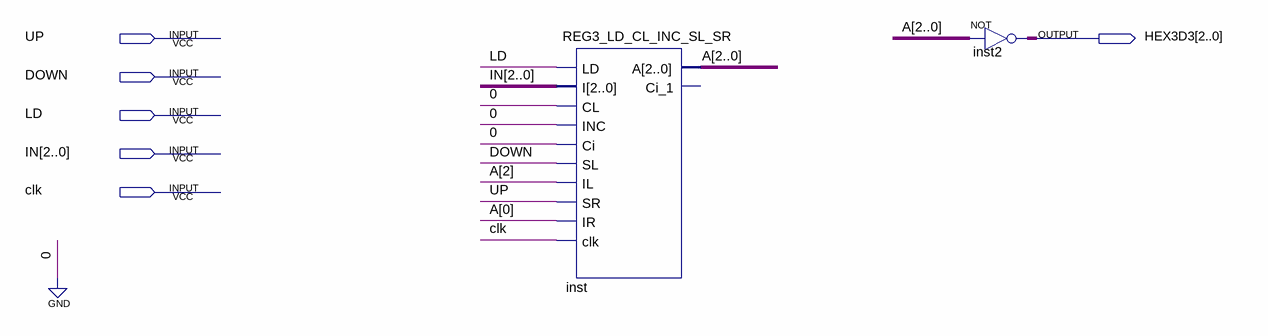
[diagram p0: schematic sheet]
// Quartus schematic main4.bdf as structural Verilog: 2 symbols, 6 pins
module main4 (
  input  UP,
  input  DOWN,
  input  LD,
  input  [2:0] IN,
  input  clk,
  output [2:0] HEX3D3
);

  wire [2:0] A;

  REG3_LD_CL_INC_SL_SR inst (
    .LD(LD), .I(IN), .CL(1'b0), .INC(1'b0), .Ci(1'b0), .SL(DOWN), .IL(A[2]), .SR(UP), .IR(A[0]), .clk(clk),
    .A(A));  // open: Ci_1
  assign HEX3D3 = ~A;  // NOT inst2, 3 bits wide
endmodule
